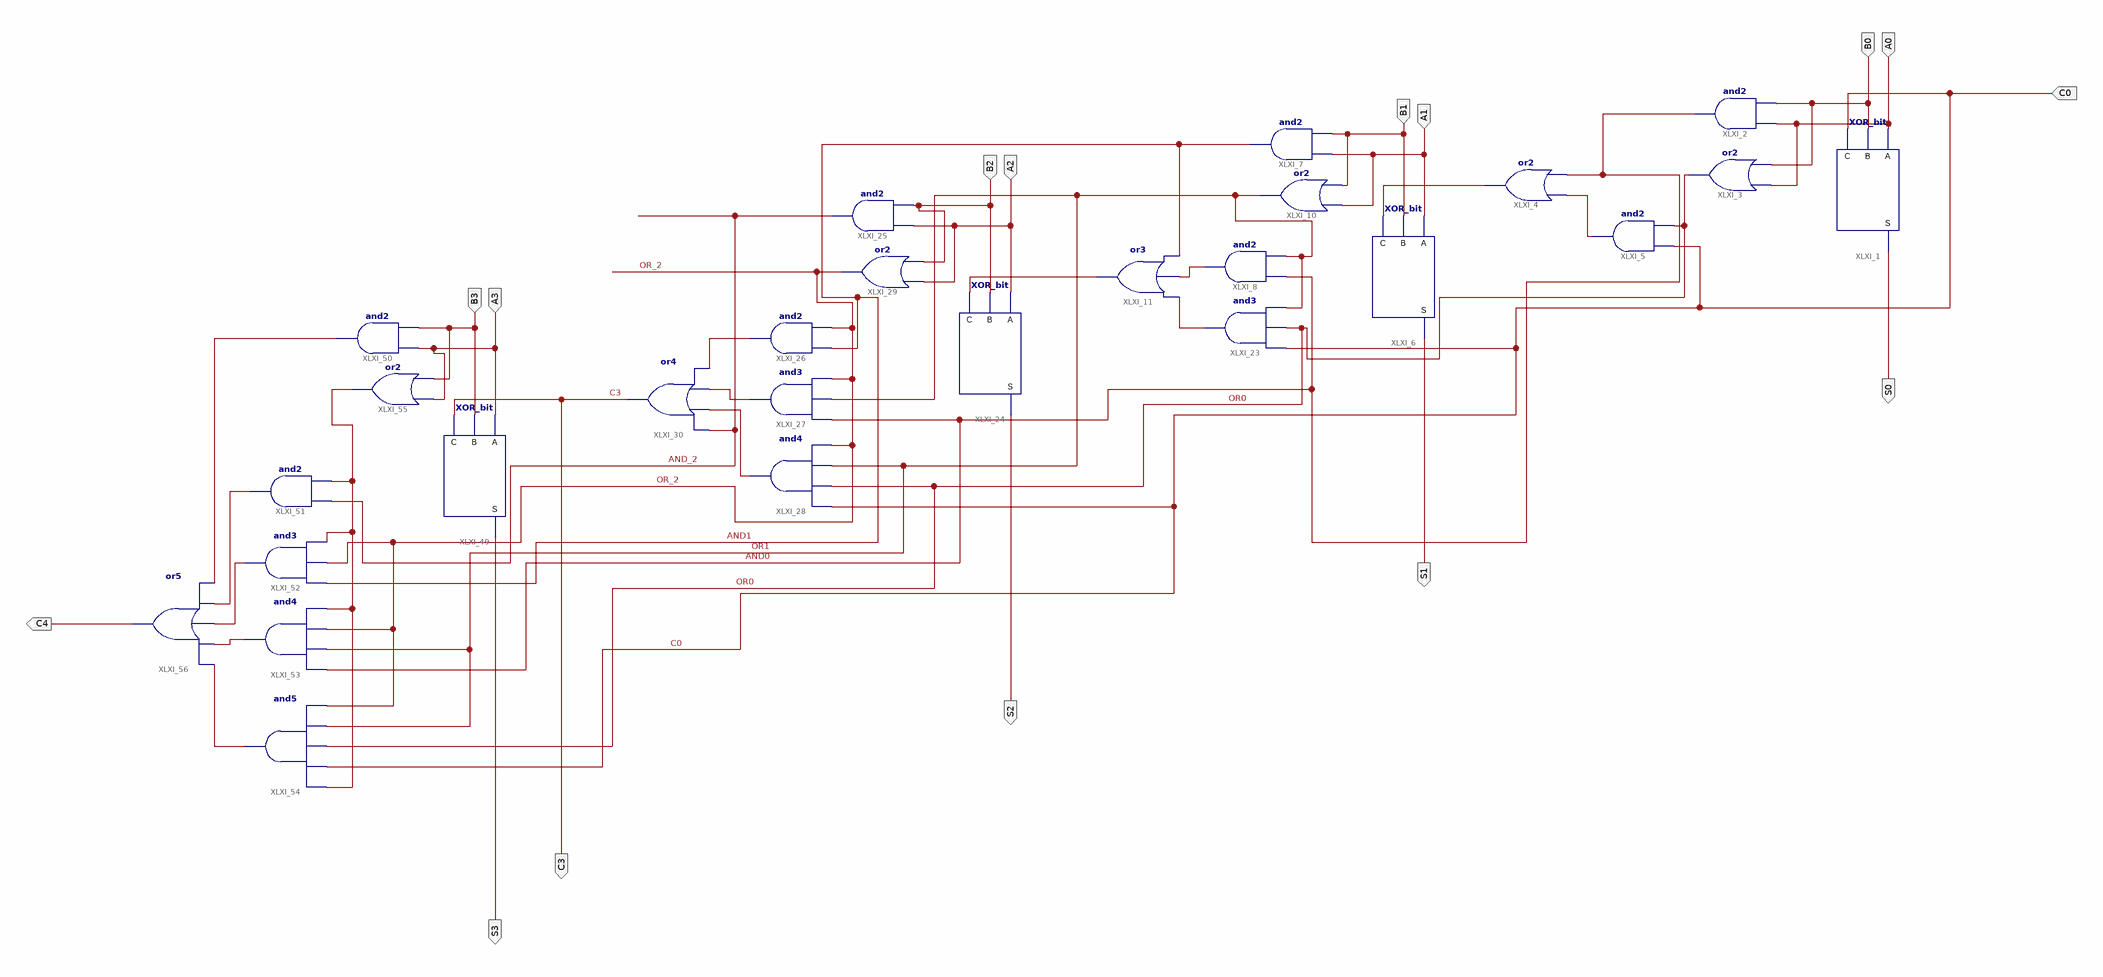
[diagram p0: schematic sheet 1]
// Xilinx ISE schematic ADD_4.sch (spartan3) as structural Verilog: 26 symbols, 15 ports
module ADD_4 (
  input  C0,
  input  B0,
  input  A0,
  input  B1,
  input  A1,
  input  B2,
  input  A2,
  input  B3,
  input  A3,
  output S0,
  output S1,
  output S2,
  output C3,
  output S3,
  output C4
);

  wire AND0, AND1, AND_2, AND_3, C1, C2, OR0, OR1, OR_2, OR_3, XLXN_10, XLXN_38, XLXN_39, XLXN_54, XLXN_55,
       XLXN_56, XLXN_112, XLXN_113, XLXN_114, XLXN_115;

  XOR_bit XLXI_1 (.A(A0), .B(B0), .C(C0), .S(S0));
  and XLXI_2 (AND0, B0, A0);
  or XLXI_3 (OR0, B0, A0);
  and XLXI_5 (XLXN_10, OR0, C0);
  or XLXI_4 (C1, AND0, XLXN_10);
  XOR_bit XLXI_6 (.A(A1), .B(B1), .C(C1), .S(S1));
  and XLXI_7 (AND1, B1, A1);
  or XLXI_10 (OR1, B1, A1);
  and XLXI_8 (XLXN_38, OR1, AND0);
  or XLXI_11 (C2, AND1, XLXN_38, XLXN_39);
  and XLXI_23 (XLXN_39, OR1, OR0, C0);
  XOR_bit XLXI_24 (.A(A2), .B(B2), .C(C2), .S(S2));
  and XLXI_25 (AND_2, B2, A2);
  and XLXI_26 (XLXN_54, OR_2, AND1);
  and XLXI_27 (XLXN_55, OR_2, OR1, AND0);
  and XLXI_28 (XLXN_56, OR_2, OR1, OR0, C0);
  or XLXI_30 (C3, XLXN_54, XLXN_55, XLXN_56, AND_2);
  or XLXI_29 (OR_2, B2, A2);
  XOR_bit XLXI_49 (.A(A3), .B(B3), .C(C3), .S(S3));
  and XLXI_50 (AND_3, B3, A3);
  and XLXI_51 (XLXN_112, OR_3, AND_2);
  and XLXI_52 (XLXN_113, OR_3, OR_2, AND1);
  and XLXI_53 (XLXN_115, OR_3, OR_2, OR1, AND0);
  and XLXI_54 (XLXN_114, OR_2, OR1, OR0, C0, OR_3);
  or XLXI_55 (OR_3, B3, A3);
  or XLXI_56 (C4, AND_3, XLXN_112, XLXN_113, XLXN_115, XLXN_114);
endmodule
